# Altium schematic sheet SDC_2.SchDoc
size 420 x 297 mm; PageSetup: Record=PageOptions|CenterHorizontal=False|CenterVertical=False|PrintScale=0.95|XCorrection=0.00|YCorrection=0.00|PrintKind=1|BorderSize=5000000|LeftOffset=0|BottomOffset=0|Orientation=1|PaperLength=1000|PaperWidth=1000|Scale=100|PaperSource=15|PrintQuality=600|MediaType=1|DitherType=10|PaperKind=A4|PrintScaleMode=1
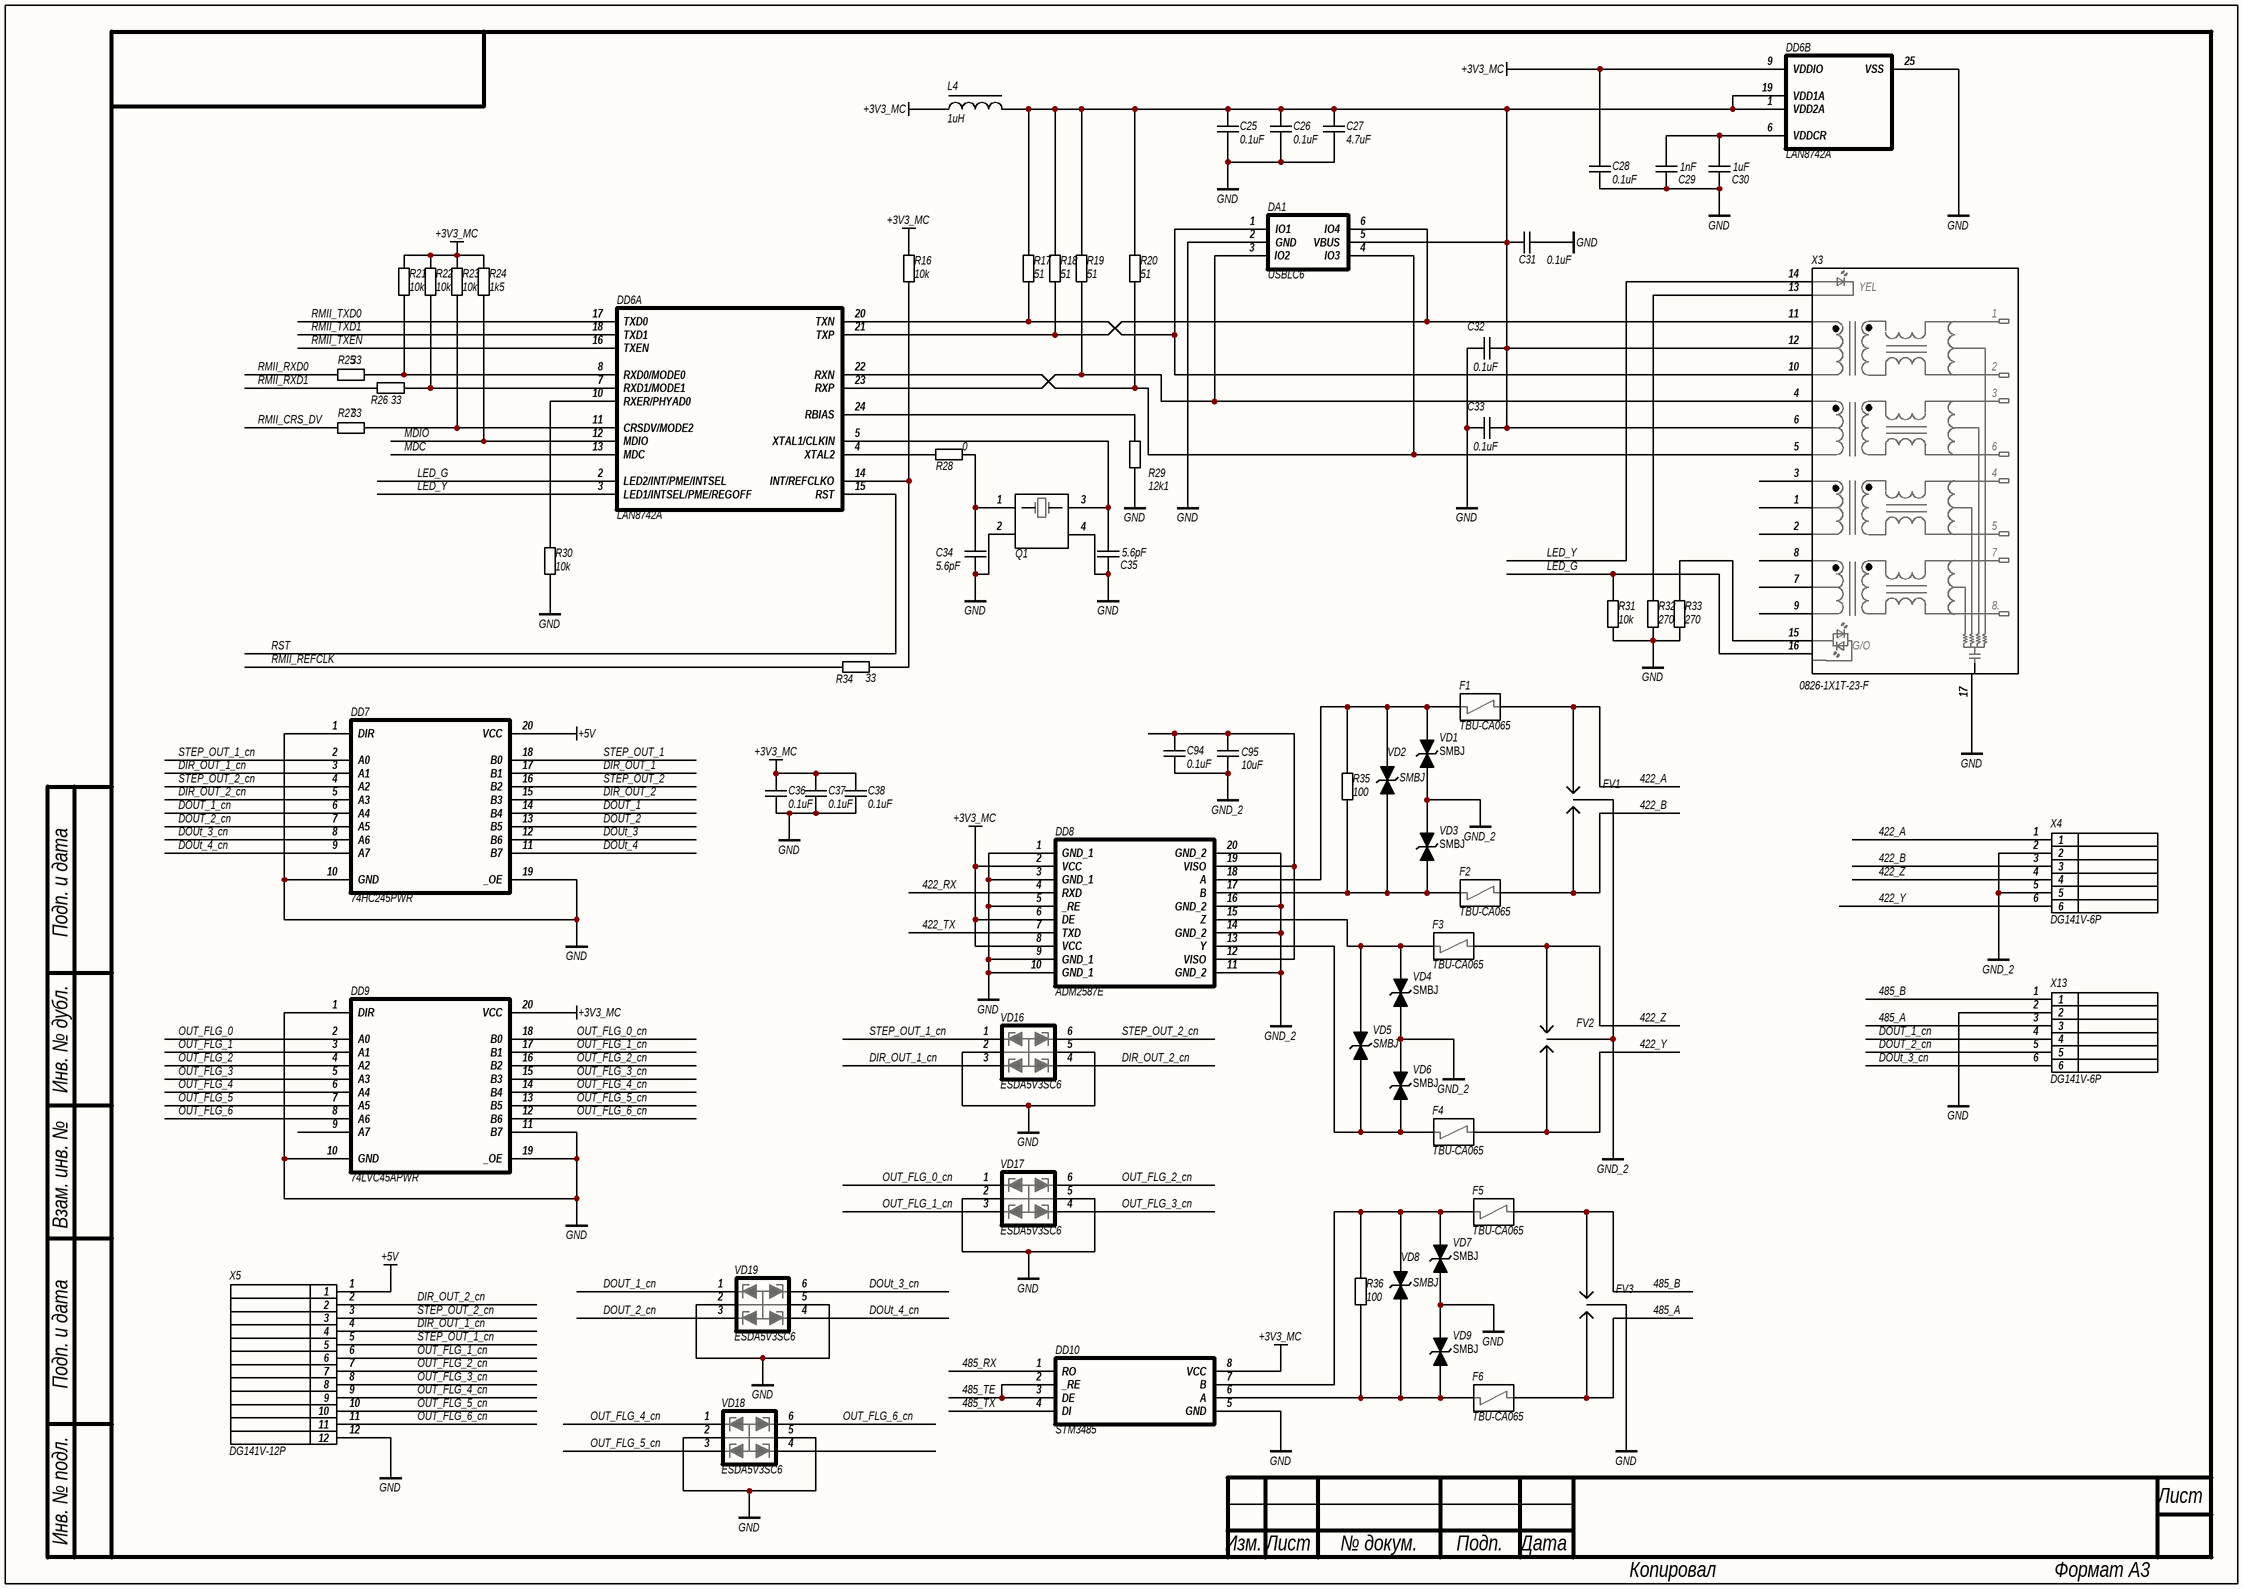
[diagram p0: SDC_2.SchDoc]

## Parts
C25  value 0.1uF  [C0603]  (hidden comment: CAP)
C26  value 0.1uF  [C0603]  (hidden comment: CAP)
C27  value 4.7uF  [C0603]  (hidden comment: CAP)
C28  value 0.1uF  [C0603]  (hidden comment: CAP)
C29  value 1nF  [C0603]  (hidden comment: CAP)
C30  value 1uF  [C0603]  (hidden comment: CAP)
C31  value 0.1uF  [C0603]  (hidden comment: CAP)
C32  value 0.1uF  [C0603]  (hidden comment: CAP)
C33  value 0.1uF  [C0603]  (hidden comment: CAP)
C34  value 5.6pF  [C0603]  (hidden comment: CAP)
C35  value 5.6pF  [C0603]  (hidden comment: CAP)
C36  value 0.1uF  [C0603]  (hidden comment: CAP)
C37  value 0.1uF  [C0603]  (hidden comment: CAP)
C38  value 0.1uF  [C0603]  (hidden comment: CAP)
C94  value 0.1uF  [C0603]  (hidden comment: CAP)
C95  value 10uF  [C1210]  (hidden comment: CAP)
DA1  USBLC6  [ESD_SOT23-6L]
DD6  LAN8742A  [QFN-MJ24]  (parts A,B of 2)
DD7  74HC245PWR  [TSSOP20]
DD8  ADM2587E  [SOIC_20W]
DD9  74LVC45APWR  [TSSOP20]
DD10  STM3485  [SO8_L]
F1  TBU-CA065  [TBU-CA]
F2  TBU-CA065  [TBU-CA]
F3  TBU-CA065  [TBU-CA]
F4  TBU-CA065  [TBU-CA]
F5  TBU-CA065  [TBU-CA]
F6  TBU-CA065  [TBU-CA]
FV1  2030-42T-SM  [2030-42T-SM]  (value not drawn)
FV2  2030-42T-SM  [2030-42T-SM]  (value not drawn)
FV3  2030-42T-SM  [2030-42T-SM]  (value not drawn)
L4  value 1uH  [LQH32CN]  (hidden comment: LQH32CN)
Q1  NX2016SA  [CRY_NX2016SA_4P]  (value not drawn)
R16  value 10k  [R0603]  (hidden comment: RES)
R17  value 51  [R0603]  (hidden comment: RES)
R18  value 51  [R0603]  (hidden comment: RES)
R19  value 51  [R0603]  (hidden comment: RES)
R20  value 51  [R0603]  (hidden comment: RES)
R21  value 10k  [R0603]  (hidden comment: RES)
R22  value 10k  [R0603]  (hidden comment: RES)
R23  value 10k  [R0603]  (hidden comment: RES)
R24  value 1k5  [R0603]  (hidden comment: RES)
R25  value 33  [R0603]  (hidden comment: RES)
R26  value 33  [R0603]  (hidden comment: RES)
R27  value 33  [R0603]  (hidden comment: RES)
R28  value 0  [R0603]  (hidden comment: RES)
R29  value 12k1  [R0603]  (hidden comment: RES)
R30  value 10k  [R0603]  (hidden comment: RES)
R31  value 10k  [R0603]  (hidden comment: RES)
R32  value 270  [R0603]  (hidden comment: RES)
R33  value 270  [R0603]  (hidden comment: RES)
R34  value 33  [R0603]  (hidden comment: RES)
R35  value 100  [R0603]  (hidden comment: RES)
R36  value 100  [R0603]  (hidden comment: RES)
VD1  SMBJ  [SMB-DO214]
VD2  SMBJ  [SMB-DO214]
VD3  SMBJ  [SMB-DO214]
VD4  SMBJ  [SMB-DO214]
VD5  SMBJ  [SMB-DO214]
VD6  SMBJ  [SMB-DO214]
VD7  SMBJ  [SMB-DO214]
VD8  SMBJ  [SMB-DO214]
VD9  SMBJ  [SMB-DO214]
VD16  ESDA5V3SC6  [SOT23-6]
VD17  ESDA5V3SC6  [SOT23-6]
VD18  ESDA5V3SC6  [SOT23-6]
VD19  ESDA5V3SC6  [SOT23-6]
X3  0826-1X1T-23-F  [0826-1X1T-23F]
X4  DG141V-6P  [DG141V-06P]
X5  DG141V-12P  [DG141V-12P]
X13  DG141V-6P  [DG141V-06P]

## Nets
+3V3_MC: C28.2 C36.2 C37.2 C38.2 DD6.9(VDDIO) DD8.2(VCC) DD8.6(DE) DD8.8(VCC) DD9.20(VCC) DD10.8(VCC) L4.1 R16.1 R21.1 R22.1 R23.1 R24.1
+5V: DD7.20(VCC) X5.1
GND: C25.1 C26.1 C27.1 C28.1 C29.1 C30.1 C31.2 C32.1 C33.1 C34.1 C35.1 C36.1 C37.1 C38.1 DA1.2(GND) DD6.25(VSS) DD7.1(DIR) DD7.10(GND) DD7.19(_OE) DD8.1(GND_1) DD8.3(GND_1) DD8.5(_RE) DD8.9(GND_1) DD8.10(GND_1) DD9.1(DIR) DD9.10(GND) DD9.11(B7) DD9.19(_OE) DD10.5(GND) FV3.2 Q1.2(OSC1) Q1.4(OSC1) R29.1 R30.1 R31.1 R32.1 R33.1 VD7.1(A) VD9.2(B) VD16.2 VD16.5 VD17.2 VD17.5 VD18.2 VD18.5 VD19.2 VD19.5 X3.17 X5.12 X13.2
GND_2: C94.1 C95.1 DD8.11(GND_2) DD8.14(GND_2) DD8.16(GND_2) DD8.20(GND_2) FV1.2 FV2.2 VD1.1(A) VD3.2(B) VD4.1(A) VD6.2(B) X4.2 X4.5
422_A: F1.2 FV1.3 X4.1
422_B: F2.2 FV1.1 X4.3
422_RX: DD8.4(RXD)
422_TX: DD8.7(TXD)
422_Y: F4.2 FV2.1 X4.6
422_Z: F3.2 FV2.3 X4.4
485_A: F6.2 FV3.1 X13.3
485_B: F5.2 FV3.3 X13.1
485_RX: DD10.1(RO)
485_TE: DD10.2(_RE) DD10.3(DE)
485_TX: DD10.4(DI)
DIR_OUT_1: DD7.17(B1)
DIR_OUT_1_cn: DD7.3(A1) VD16.3 X5.4
DIR_OUT_2: DD7.15(B3)
DIR_OUT_2_cn: DD7.5(A3) VD16.4 X5.2
DOUT_1: DD7.14(B4)
DOUT_1_cn: DD7.6(A4) VD19.1 X13.4
DOUT_2: DD7.13(B5)
DOUT_2_cn: DD7.7(A5) VD19.3 X13.5
DOUt_3: DD7.12(B6)
DOUt_3_cn: DD7.8(A6) VD19.6 X13.6
DOUt_4: DD7.11(B7)
DOUt_4_cn: DD7.9(A7) VD19.4
LED_G: DD6.2(LED2/INT/PME/INTSEL) R31.2 X3.16
LED_Y: DD6.3(LED1/INTSEL/PME/REGOFF) X3.14
MDC: DD6.13(MDC)
MDIO: DD6.12(MDIO) R24.2
OUT_FLG_0: DD9.2(A0)
OUT_FLG_0_cn: DD9.18(B0) VD17.1
OUT_FLG_1: DD9.3(A1)
OUT_FLG_1_cn: DD9.17(B1) VD17.3 X5.6
OUT_FLG_2: DD9.4(A2)
OUT_FLG_2_cn: DD9.16(B2) VD17.6 X5.7
OUT_FLG_3: DD9.5(A3)
OUT_FLG_3_cn: DD9.15(B3) VD17.4 X5.8
OUT_FLG_4: DD9.6(A4)
OUT_FLG_4_cn: DD9.14(B4) VD18.1 X5.9
OUT_FLG_5: DD9.7(A5)
OUT_FLG_5_cn: DD9.13(B5) VD18.3 X5.10
OUT_FLG_6: DD9.8(A6)
OUT_FLG_6_cn: DD9.12(B6) VD18.6 X5.11
RMII_CRS_DV: R27.2
RMII_REFCLK: R34.2
RMII_RXD0: R25.2
RMII_RXD1: R26.2
RMII_TXD0: DD6.17(TXD0)
RMII_TXD1: DD6.18(TXD1)
RMII_TXEN: DD6.16(TXEN)
RST: DD6.15(RST)
STEP_OUT_1: DD7.18(B0)
STEP_OUT_1_cn: DD7.2(A0) VD16.1 X5.5
STEP_OUT_2: DD7.16(B2)
STEP_OUT_2_cn: DD7.4(A2) VD16.6 X5.3
NetC25_2: C25.2 C26.2 C27.2 C31.1 C32.2 C33.2 DA1.5(VBUS) DD6.1(VDD2A) DD6.19(VDD1A) L4.2 R17.2 R18.2 R19.2 R20.2 X3.6 X3.12
NetC29_2: C29.2 C30.2 DD6.6(VDDCR)
NetC34_2: C34.2 Q1.1(OSC1) R28.1
NetC35_2: C35.2 DD6.5(XTAL1/CLKIN) Q1.3(OSC2)
NetC94_2: C94.2 C95.2 DD8.12(VISO) DD8.19(VISO)
NetDA1_1: DA1.1(IO1) DD6.20(TXN) R17.1 X3.10
NetDA1_3: DA1.3(IO2) DD6.23(RXP) R19.1 X3.4
NetDA1_4: DA1.4(IO3) DD6.22(RXN) R20.1 X3.5
NetDA1_6: DA1.6(IO4) DD6.21(TXP) R18.1 X3.11
NetDD6_4: DD6.4(XTAL2) R28.2
NetDD6_7: DD6.7(RXD1/MODE1) R22.2 R26.1
NetDD6_8: DD6.8(RXD0/MODE0) R21.2 R25.1
NetDD6_10: DD6.10(RXER/PHYAD0) R30.2
NetDD6_11: DD6.11(CRSDV/MODE2) R23.2 R27.1
NetDD6_14: DD6.14(INT/REFCLKO) R16.2 R34.1
NetDD6_24: DD6.24(RBIAS) R29.2
NetDD8_13: DD8.13(Y) F4.1 VD5.1(A) VD6.1(A)
NetDD8_15: DD8.15(Z) F3.1 VD4.2(B) VD5.2(B)
NetDD8_17: DD8.17(B) F2.1 R35.2 VD2.1(A) VD3.1(A)
NetDD8_18: DD8.18(A) F1.1 R35.1 VD1.2(B) VD2.2(B)
NetDD10_6: DD10.6(A) F6.1 R36.2 VD8.1(A) VD9.1(A)
NetDD10_7: DD10.7(B) F5.1 R36.1 VD7.2(B) VD8.2(B)
NetR32_2: R32.2 X3.13
NetR33_2: R33.2 X3.15

Not connected (* = marked no-connect by the designer): DD9 9(A7); VD18 4; X3 1 2 3 7 8 9

## Notes on the sheet
- Подп. и дата
- Инв. № дубл.
- Взам. инв. №
- Инв. № подл.
- Лист
- Изм.
- № докум.
- Подп.
- Дата
- Копировал
- Формат А3
- (in symbol 0826-1X1T-23-F) YEL; 8.; G/O

## Library data of the parts
C25-C38 C94 = CAP: SMD Capacitor; Manufacturer: Murata; Material: X7R; Tolerance: 10%; Voltage: 50V; Type: Ceramic Capacitor
C95 = CAP: SMD Capacitor; Manufacturer: Murata; Material: X7R; Tolerance: 10%; Voltage: 10V; Type: Ceramic Capacitor
DA1 = USBLC6-4SC6: ESD protection Very low capacitance; Manufacturer: ST
DD6 = LAN8742A: RMII 10/100 Ethernet PHY
DD8 = ADM2587E: RS485 isolator
DD10 = ST3485EB: RS485_tranciever
F1-F6 = TBU-CA065: TBU fuse
FV1-FV3 = 2030-42T-SM: Charger
L4 = LQH32CN: chip inductor
Q1 = NX2016SA: Crystal oscillator 25MHz; Manufacturer: NDK; value: 25MHz
R16-R36 = RES: SMD Resistor; Name: Chip SMD Resistor; Power: 0.062 Wt; Tolerance: 5%; Temperature Range: -55…155°C
VD1 VD3 VD4 VD6 VD7 VD9 = SMBJ5CA: TVS diode
VD2 VD5 VD8 = SMBJ12CA: TVSdiode
VD16-VD19 = ESDA5V3SC6: 4-line ESD protection
X3 = 0826-1X1T-23-F: 1Gb connector
X4 X13 = DG141V-6P: wire connector
X5 = DG141V-12P: wire connector